# Altium schematic sheet Gyro.SchDoc: Gyro
size A4; SheetNumber: 9; SheetTotal: 13
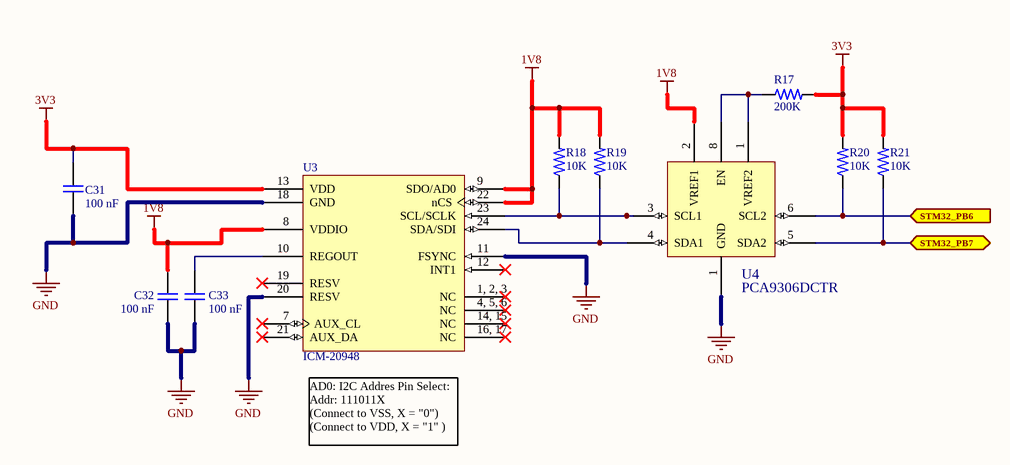
[diagram p0: Gyro.SchDoc]

## Parts
C31  100 nF  [MergenElektronik_Capacitors_Ceramics_SMDs_0603_M_NS]
C32  100 nF  [MergenElektronik_Capacitors_Ceramics_SMDs_0603_M_NS]
C33  100 nF  [MergenElektronik_Capacitors_Ceramics_SMDs_0603_M_NS]
R17  200K  [MergenElektronik_Resistors_ChipResistors_0603_M_NS]
R18  10K  [MergenElektronik_Resistors_ChipResistors_0603_M_NS]
R19  10K  [MergenElektronik_Resistors_ChipResistors_0603_M_NS]
R20  10K  [MergenElektronik_Resistors_ChipResistors_0603_M_NS]
R21  10K  [MergenElektronik_Resistors_ChipResistors_0603_M_NS]
U3  ICM-20948  [MergenElektronik_Sensors_Gyroscope-Accelerometer-Magnetometer_24-QFN]
U4  PCA9306DCTR  [MergenElektronik_Logics_LevelShifters_SSOP-8]

## Ports
STM32_PB6 (in, see Altimeter[3B], GPS[3B], Microcontroller[2C], PressureandTemperature[3B]), STM32_PB7 (bidir, see Altimeter[3B], GPS[3B], Microcontroller[2C], PressureandTemperature[3B])

## Nets
1V8: C32.1 R18.2 R19.2 U3.8(VDDIO) U3.9(SDO/AD0) U3.22(nCS) U4.2(VREF1)
3V3: C31.1 R17.2 R20.2 R21.2 U3.13(VDD)
GND: C31.2 C32.2 C33.2 U3.11(FSYNC) U3.18(GND) U3.20(RESV) U4.1(GND)
STM32_PB6: R20.1 U4.6(SCL2) ; port STM32_PB6
STM32_PB7: R21.1 U4.5(SDA2) ; port STM32_PB7
NetC33_1: C33.1 U3.10(REGOUT)
NetR17_1: R17.1 U4.1(VREF2) U4.8(EN)
NetR18_1: R18.1 U3.23(SCL/SCLK) U4.3(SCL1)
NetR19_1: R19.1 U3.24(SDA/SDI) U4.4(SDA1)

Not connected (* = marked no-connect by the designer): U3 1, 2, 3(NC)* 4, 5, 6(NC)* 7(AUX_CL)* 12(INT1)* 14, 15(NC)* 16, 17(NC)* 19(RESV)* 21(AUX_DA)*

## Notes on the sheet
- (near U3) AD0: I2C Addres Pin Select:
  Addr: 111011X
  (Connect to VSS, X = "0")
  (Connect to VDD, X = "1" )
- Title:
- Size:
- Date:
- A4
- Number:
- Time:
- Revision:
- Sheet
- of
- Project
- Drawn By :

## Library data of the parts
C31-C33 = MergenElektronik_Capacitors_Ceramic_SMDs_100nF_100V: Mergen Elektronik - Capacitors - Ceramics - SMDs - 0603 - 100 nF - 100V; Manufacturer: Samsung Electro-Mechanics; Manufacturer Number: CL10B104KC8NNNC; Model: Ceramic Capacitors; Tolerance: ±10%; Value: 100 nF; Temperature: -55°C up to +125°C; Digi-Key Number: 1276-6807-1-ND; Package: 0603(1608 Metric); Mouser Number: 187-CL10B104KC8NNNC; Mounting Type: Surface Mount; Farnell Number: 3013412; Özdisan Number: CL10B104KC8NNNC; Supplier 1: Digikey; Supplier 2: Mouser; Supplier Part Number 1: 1276-6807-1-ND; Supplier Part Number 2: 187-CL10B104KC8NNNC; Voltage Rating: 100V
R17 = MergenElektronik_Resistors_ChipResistors_0603_200K: Mergen Elektronik - Resistors - Chip Resistors - 0603 - 200K; Manufacturer: Stackpole Electronics Inc; Manufacturer Number: RMCF0603FT200K; Value: Chip Resistor - 0603 - 200K; Power: 1/10W; Tolerance: ±1%; Package: 0603(1608); Temperature: -55°C up to +155°C - X8R; Model: Chip Resistor; Digi-Key Number: RMCF0603FT200KTR-ND; Mounting Type: Surface Mount; Mouser Number: 708-RMCF0603FT200K; Supplier 1: Digikey; Supplier 2: Mouser; Supplier Part Number 1: RMCF0603FT200KTR-ND; Supplier Part Number 2: 708-RMCF0603FT200K
R18-R21 = MergenElektronik_Resistors_ChipResistors_0603_10K: Mergen Elektronik - Resistors - Chip Resistors - 0603 - 10K; Manufacturer: Stackpole Electronics Inc; Manufacturer Number: RMCF0603JT10K0; Value: Chip Resistor - 0603 - 10K; Power: 1/10W; Tolerance: ±5%; Package: 0603(1608); Temperature: -55°C up to +155°C - X8R; Model: Chip Resistor; Digi-Key Number: RMCF0603JT10K0CT-ND; Mounting Type: Surface Mount; Supplier 1: Digi-Key; Supplier Part Number 1: RMCF0603JT10K0-ND
U3 = MergenElektronik_Sensors_Gyroscope-Accelerometer-Magnetometer_ICM-20948: Mergen Elektronik - Sensors - Gytoscope - Accelometer - Magnetometer - ICM-20948; Manufacturer: TDK InvenSense; Model: Gyroscope-Accelerometer-Magnetometer Sensor; Operating Supply Voltage: 1.7VDC up to 3.6VDC; Output Type: I2C, SPI; Digi-Key Number: 1428-1123-2-ND; Manufacturer Number: ICM-20948; Mounting Type: Surface Mount; Mouser Number: 410-ICM-20948; Farnell Number: 2911498; Özdisan Number: ICM-20948; Package: 24-QFN; Temperature: -40°C up to 85°C; Supplier 1: Digi-Key; Supplier Number 1: 1428-1123-2-ND; Supplier 2: Mouser; Supplier Number 2: 410-ICM-20948
U4 = MergenElektronik_Logics_LevelShifters_PCA9306DCTR: Mergen Elektronik - Logics - Level Shifters - PCA9306DCTR; Manufacturer: Texas Instruments; Outpu Type: Open Drain, Push-Pull; Circuit Channels: 2; Voltage Rating: 1.2V up to 5.5V; Digi-Key Number: 296-18509-2-ND; Manufacturer Number: PCA9306DCTR; Model: Level Shifters; Mounting Type: Surface Mount; Mouser Number: 595-PCA9306DCTR; Package: SSOP-8; Temperature: -40°C up to +105°C; Value: PCA9306DCTR; Farnell Number: 3120911; Supplier 1: Digi-Key; Supplier 2: Mouser; Supplier Part Number 2: 595-PCA9306DCTR; Features: Auto-Direction Sensing; Applications: I2C, UART , SMBUS, PMBUS, Two Signal Interfaces; Supplier Part Number 1: 296-18509-2-ND